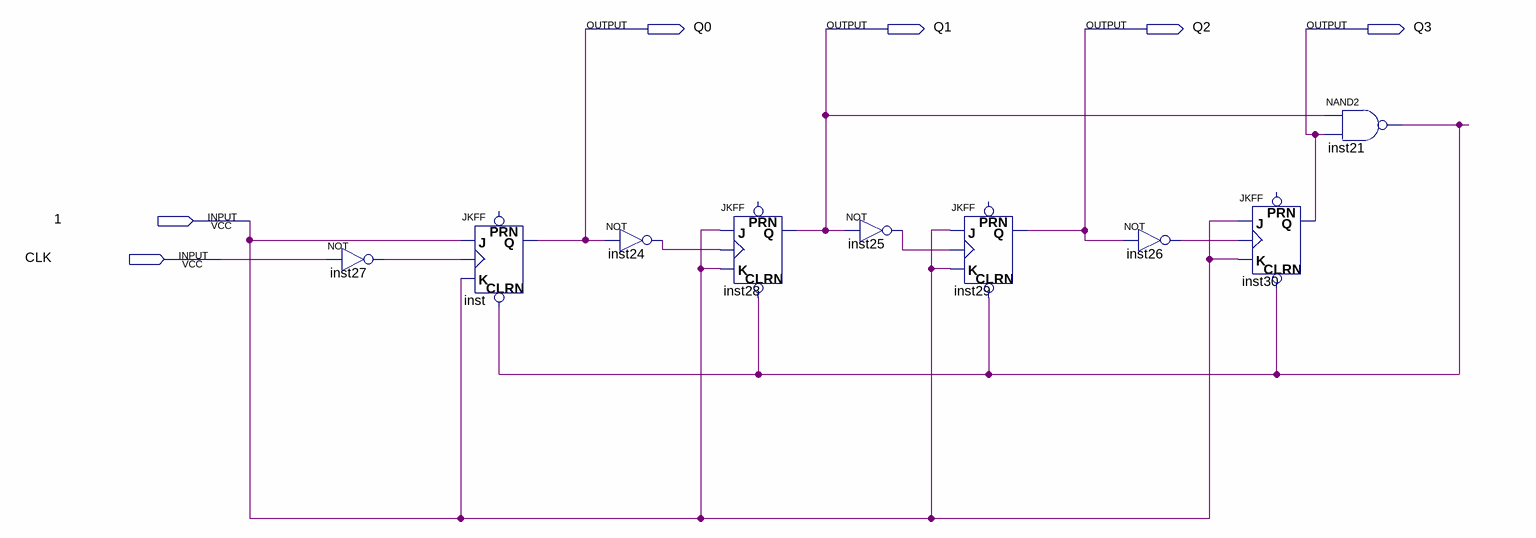
[diagram p0: schematic sheet]
// Quartus schematic CountDec.bdf as structural Verilog: 9 symbols, 6 pins
module CountDec (
  input  \1 ,
  input  CLK,
  output Q0,
  output Q1,
  output Q2,
  output Q3
);

  wire inst21_out, inst24_out, inst25_out, inst26_out, inst27_out;

  not inst27 (inst27_out, CLK);
  JKFF inst (.CLRN(inst21_out), .K(\1 ), .J(\1 ), .CLK(inst27_out), .Q(Q0));  // open: PRN
  not inst24 (inst24_out, Q0);
  JKFF inst28 (.CLRN(inst21_out), .K(\1 ), .J(\1 ), .CLK(inst24_out), .Q(Q1));  // open: PRN
  not inst25 (inst25_out, Q1);
  JKFF inst29 (.CLRN(inst21_out), .K(\1 ), .J(\1 ), .CLK(inst25_out), .Q(Q2));  // open: PRN
  not inst26 (inst26_out, Q2);
  JKFF inst30 (.CLRN(inst21_out), .K(\1 ), .J(\1 ), .CLK(inst26_out), .Q(Q3));  // open: PRN
  nand inst21 (inst21_out, Q1, Q3);
endmodule
